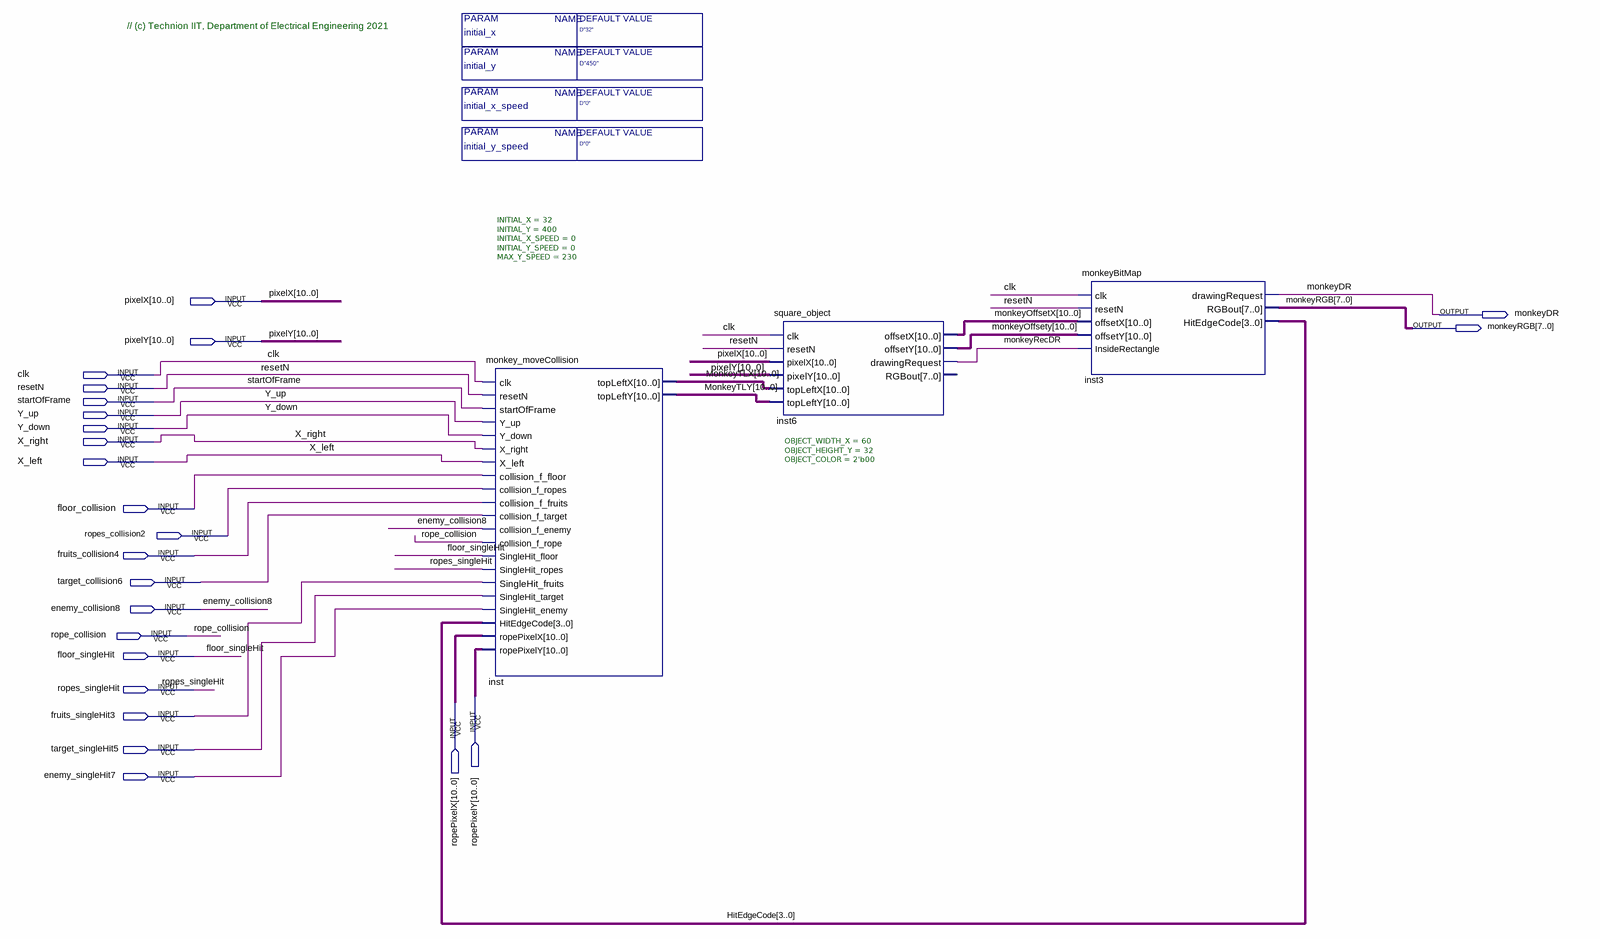
[diagram p0: schematic sheet]
// Quartus schematic Monkey_Block.bdf as structural Verilog: 3 symbols, 24 pins
module Monkey_Block #(parameter initial_x_speed = "D\"0\"", parameter initial_y = "D\"450\"", parameter initial_x = "D\"32\"", parameter initial_y_speed = "D\"0\"") (
  input  [10:0] pixelX,
  input  [10:0] pixelY,
  input  clk,
  input  resetN,
  input  startOfFrame,
  input  Y_up,
  input  Y_down,
  input  X_right,
  input  X_left,
  input  floor_collision,
  input  ropes_collision2,
  input  fruits_collision4,
  input  target_collision6,
  input  enemy_collision8,
  input  rope_collision,
  input  floor_singleHit,
  input  ropes_singleHit,
  input  [10:0] ropePixelY,
  input  [10:0] ropePixelX,
  input  fruits_singleHit3,
  input  target_singleHit5,
  input  enemy_singleHit7,
  output monkeyDR,
  output [7:0] monkeyRGB
);

  wire monkeyRecDR;
  wire [3:0] HitEdgeCode;
  wire [10:0] monkeyOffsetX, monkeyOffsety, MonkeyTLX, MonkeyTLY;

  monkey_moveCollision #(.INITIAL_X(32), .INITIAL_Y(400), .INITIAL_X_SPEED(0), .INITIAL_Y_SPEED(0), .MAX_Y_SPEED(230)) inst (
    .clk(clk), .resetN(resetN), .startOfFrame(startOfFrame), .Y_up(Y_up), .Y_down(Y_down), .X_right(X_right),
    .X_left(X_left), .collision_f_floor(floor_collision), .collision_f_ropes(ropes_collision2),
    .collision_f_fruits(fruits_collision4), .collision_f_target(target_collision6),
    .collision_f_enemy(enemy_collision8), .collision_f_rope(rope_collision),
    .SingleHit_floor(floor_singleHit), .SingleHit_ropes(ropes_singleHit),
    .SingleHit_fruits(fruits_singleHit3), .SingleHit_target(target_singleHit5),
    .SingleHit_enemy(enemy_singleHit7), .HitEdgeCode(HitEdgeCode), .ropePixelX(ropePixelX),
    .ropePixelY(ropePixelY), .topLeftX(MonkeyTLX), .topLeftY(MonkeyTLY));
  square_object #(.OBJECT_WIDTH_X(60), .OBJECT_HEIGHT_Y(32), .OBJECT_COLOR(2'b00)) inst6 (
    .clk(clk), .resetN(resetN), .pixelX(pixelX), .pixelY(pixelY), .topLeftX(MonkeyTLX), .topLeftY(MonkeyTLY),
    .offsetX(monkeyOffsetX), .offsetY(monkeyOffsety), .drawingRequest(monkeyRecDR));  // open: RGBout
  monkeyBitMap inst3 (
    .clk(clk), .resetN(resetN), .offsetX(monkeyOffsetX), .offsetY(monkeyOffsety),
    .InsideRectangle(monkeyRecDR), .drawingRequest(monkeyDR), .RGBout(monkeyRGB), .HitEdgeCode(HitEdgeCode));

  // Notes on the sheet:
  //   // (c) Technion IIT, Department of Electrical Engineering 2021
endmodule
